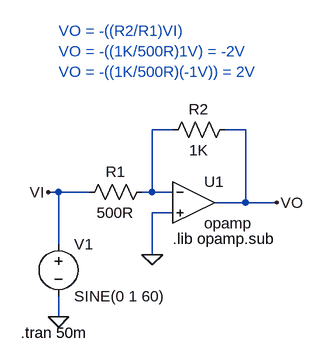
[diagram p0: schematic AMP03 - O Amplificador Inversor.asc]
AMP03 - O Amplificador Inversor.asc, the LTspice schematic file:
Version 4
SHEET 1 880 680
WIRE 144 16 112 16
WIRE 256 16 224 16
WIRE -32 112 -48 112
WIRE 16 112 -32 112
WIRE 112 112 112 16
WIRE 112 112 96 112
WIRE 144 112 112 112
WIRE 256 128 256 16
WIRE 256 128 208 128
WIRE 304 128 256 128
WIRE 144 144 112 144
WIRE -32 192 -32 112
WIRE 112 208 112 144
WIRE -32 304 -32 272
FLAG 112 208 0
FLAG -48 112 VI
FLAG 304 128 VO
FLAG -32 304 0
SYMBOL Opamps\\opamp 176 64 R0
SYMATTR InstName U1
SYMBOL res 112 96 R90
WINDOW 0 0 56 VBottom 2
WINDOW 3 32 56 VTop 2
SYMATTR InstName R1
SYMATTR Value 500R
SYMBOL res 240 0 R90
WINDOW 0 0 56 VBottom 2
WINDOW 3 32 56 VTop 2
SYMATTR InstName R2
SYMATTR Value 1K
SYMBOL voltage -32 176 R0
WINDOW 123 0 0 Left 2
WINDOW 39 0 0 Left 2
SYMATTR InstName V1
SYMATTR Value SINE(0 1 60)
TEXT 144 184 Left 2 !.lib opamp.sub
TEXT -32 -136 Left 2 ;VO = -((R2/R1)VI) \nVO = -((1K/500R)1V) = -2V\nVO = -((1K/500R)(-1V)) = 2V
TEXT -90 328 Left 2 !.tran 50m

The netlist it stands for:
* AMP03 - O Amplificador Inversor.asc
XU1 N001 0 VO opamp Aol=100K GBW=10Meg  ; pins invin noninvin out
R1 N001 VI 500R
R2 VO N001 1K
V1 VI 0 SINE(0 1 60)
.lib opamp.sub
* VO = -((R2/R1)VI)
* VO = -((1K/500R)1V) = -2V
* VO = -((1K/500R)(-1V)) = 2V
.tran 50m
.backanno
.end